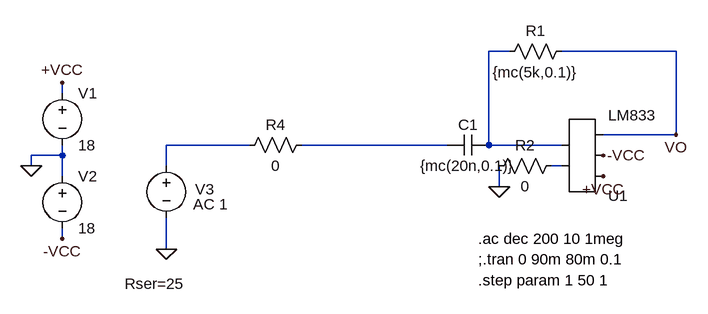
[diagram p0: schematic Draft2.asc]
Draft2.asc, the LTspice schematic file:
Version 4
SHEET 1 980 680
WIRE 688 -160 656 -160
WIRE 944 -160 768 -160
WIRE 0 -96 0 -112
WIRE 944 -32 944 -160
WIRE 944 -32 832 -32
WIRE 288 -16 160 -16
WIRE 592 -16 368 -16
WIRE 656 -16 656 -160
WIRE 768 -16 656 -16
WIRE 0 0 0 -16
WIRE 0 0 -48 0
WIRE -48 16 -48 0
WIRE 160 16 160 -16
WIRE 768 16 752 16
WIRE 0 32 0 0
WIRE 672 48 672 16
WIRE 0 128 0 112
WIRE 160 144 160 96
FLAG -48 16 0
FLAG 0 -112 +VCC
FLAG 0 128 -VCC
FLAG 672 48 0
FLAG 160 144 0
FLAG 944 -32 VO
FLAG 832 32 +VCC
FLAG 832 0 -VCC
SYMBOL voltage 0 -112 R0
WINDOW 123 0 0 Left 0
WINDOW 39 0 0 Left 0
SYMATTR InstName V1
SYMATTR Value 18
SYMBOL voltage 0 16 R0
WINDOW 123 0 0 Left 0
WINDOW 39 0 0 Left 0
SYMATTR InstName V2
SYMATTR Value 18
SYMBOL cap 656 -32 R90
WINDOW 0 0 32 VBottom 2
WINDOW 3 32 32 VTop 2
SYMATTR InstName C1
SYMATTR Value {mc(20n,0.1)}
SYMBOL res 784 -176 R90
WINDOW 0 0 56 VBottom 2
WINDOW 3 32 56 VTop 2
SYMATTR InstName R1
SYMATTR Value {mc(5k,0.1)}
SYMBOL AutoGenerated\\LM833 800 0 M180
SYMATTR InstName U1
SYMBOL voltage 160 0 R0
WINDOW 3 -19 265 Left 2
WINDOW 123 41 75 Left 2
WINDOW 39 -64 197 Left 2
WINDOW 0 44 52 Left 2
SYMATTR Value ""
SYMATTR Value2 AC 1
SYMATTR SpiceLine Rser=25
SYMATTR InstName V3
SYMBOL res 768 0 R90
WINDOW 0 0 56 VBottom 2
WINDOW 3 32 56 VTop 2
SYMATTR InstName R2
SYMATTR Value 0
SYMBOL res 384 -32 R90
WINDOW 0 0 56 VBottom 2
WINDOW 3 32 56 VTop 2
SYMATTR InstName R4
SYMATTR Value 0
TEXT 640 128 Left 2 !.ac dec 200 10 1meg
TEXT 640 160 Left 2 !;.tran 0 90m 80m 0.1
TEXT 640 192 Left 2 !.step param 1 50 1

The netlist it stands for:
* Draft2.asc
V1 +VCC 0 18
V2 0 -VCC 18
C1 N001 N003 {mc(20n,0.1)}
R1 VO N001 {mc(5k,0.1)}
* U1: LM833 (symbol AutoGenerated\LM833 not available, pins judged from their places): pin1=N004 pin2=N001 pin3=+VCC pin4=-VCC pin5=VO
V3 N002 0 AC 1 Rser=25
R2 N004 0 0
R4 N003 N002 0
.ac dec 200 10 1meg
;.tran 0 90m 80m 0.1
.step param 1 50 1
.backanno
.end